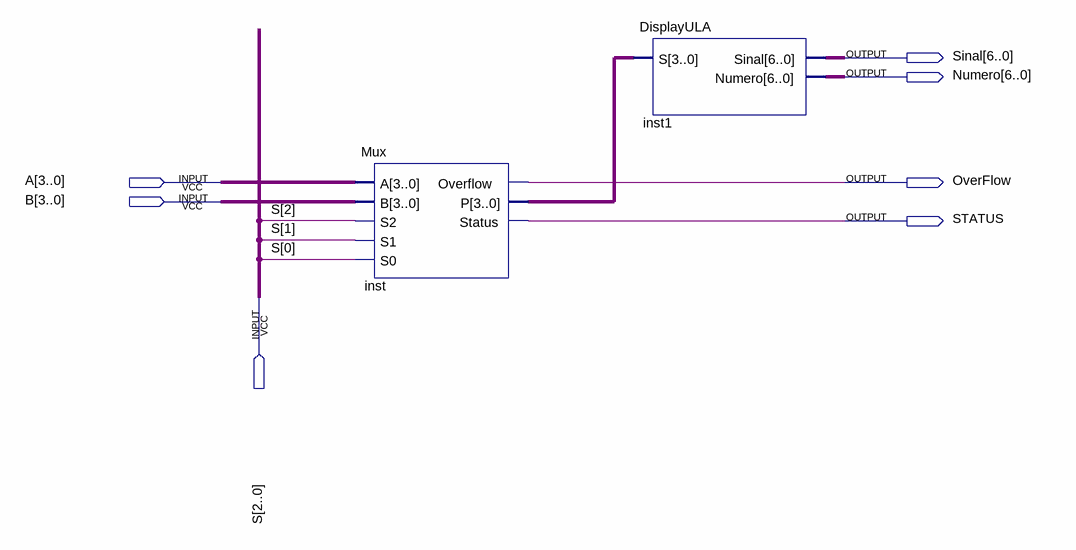
[diagram p0: schematic sheet]
// Quartus schematic ULA.bdf as structural Verilog: 2 symbols, 7 pins
module ULA (
  input  [3:0] A,
  input  [3:0] B,
  input  [2:0] S,
  output [6:0] Sinal,
  output [6:0] Numero,
  output OverFlow,
  output STATUS
);

  wire [3:0] inst_p;

  Mux inst (.A(A), .B(B), .S2(S[2]), .S1(S[1]), .S0(S[0]), .Overflow(OverFlow), .P(inst_p), .Status(STATUS));
  DisplayULA inst1 (.S(inst_p), .Sinal(Sinal), .Numero(Numero));
endmodule
